# EAGLE design TurquoiseBicuspid_v2 (EAGLE 6.5.0)
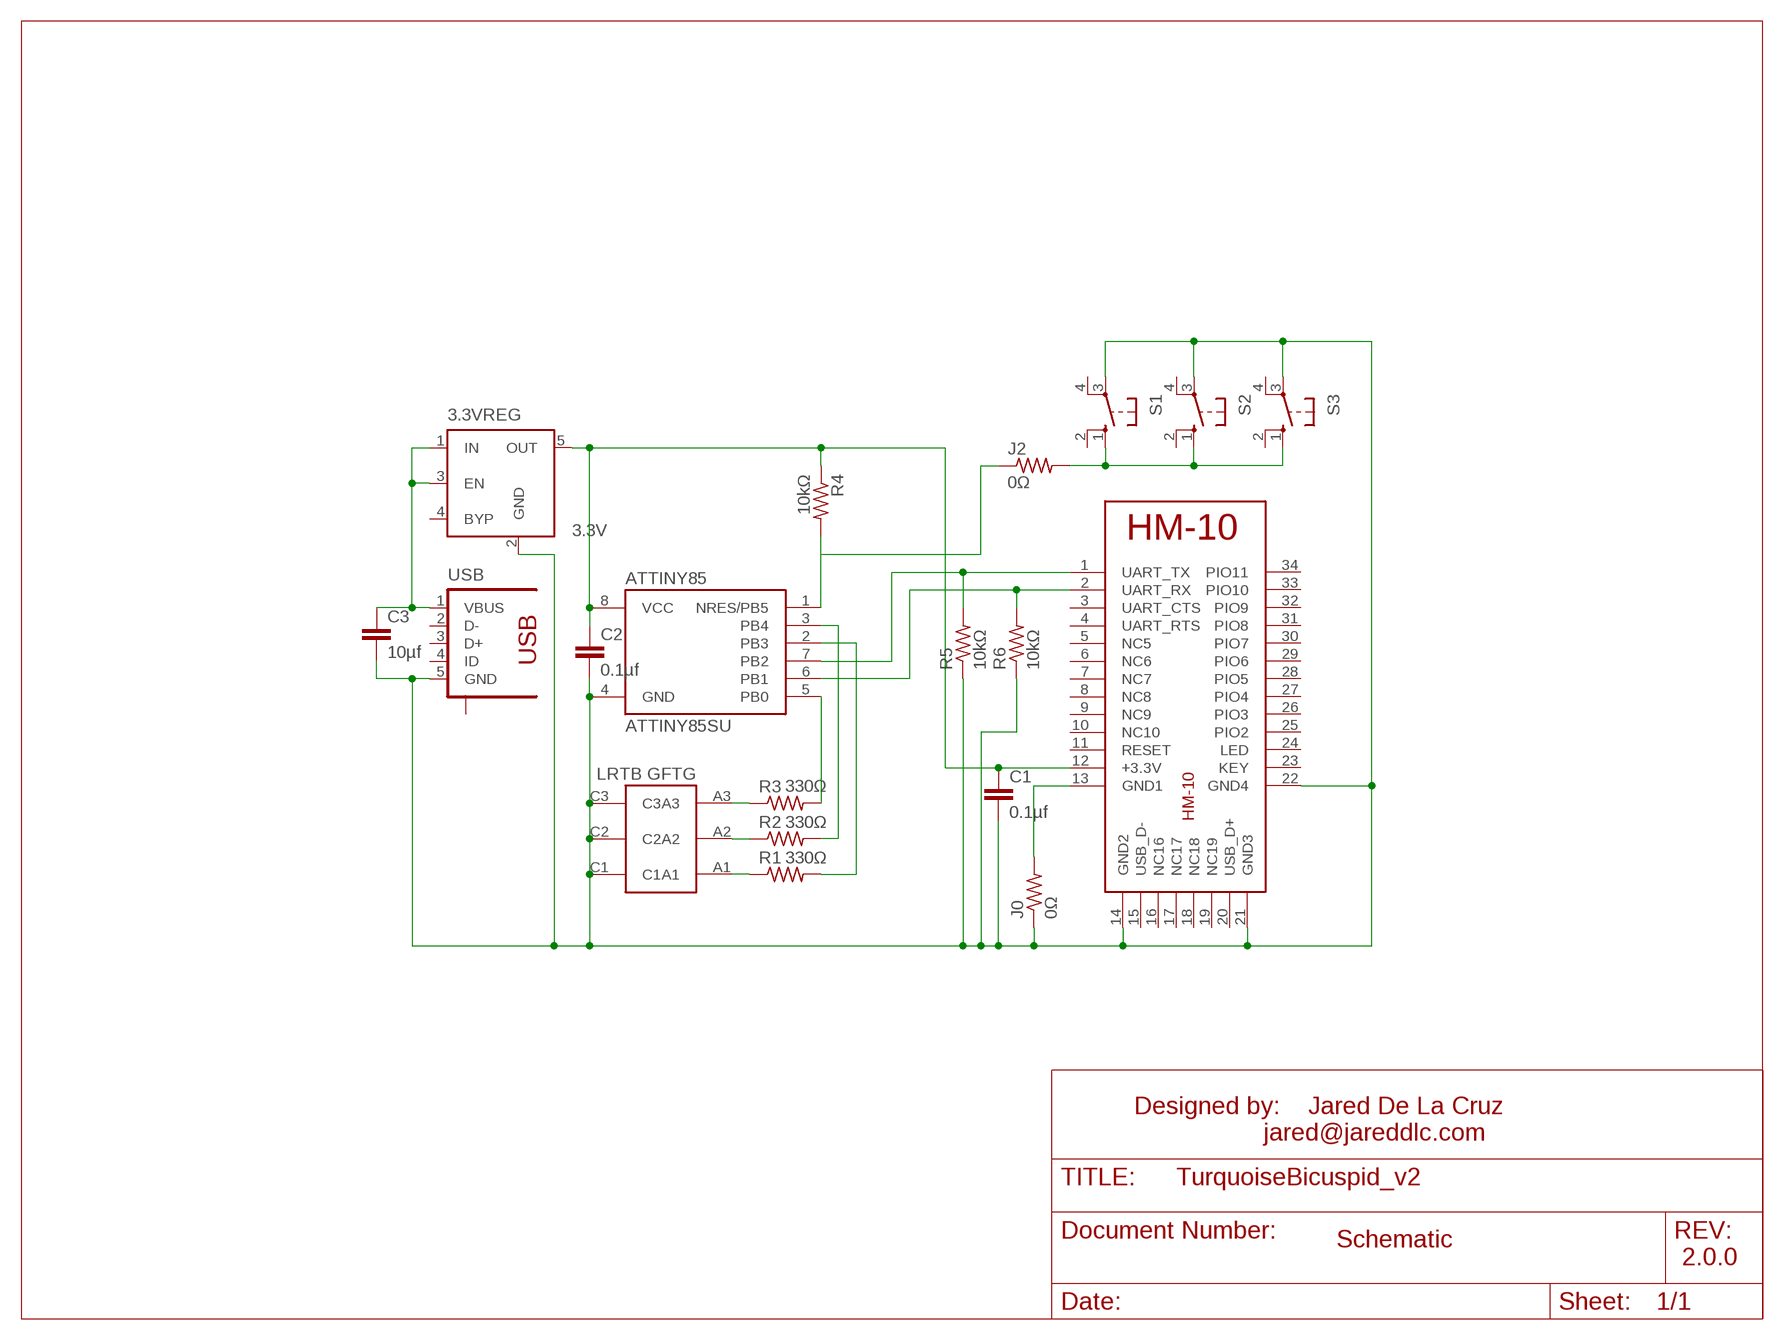
[diagram p0: schematic, sheet 1]
FRAME1 (LETTER_L): VERSION: 2.0.0

## Parts
3.3VREG  3.3V  MIC5219XX  [SOT23-5]
ATTINY85  ATTINY85SU  [ATTINY85]
C1  0.1µf  C-EUC1206  [C1206]
C2  0.1µf  C-EUC1206  [C1206]
C3  10µf  C-EUC1206  [C1206]
HM-10  HM-10BOARD  [HM-10]
J0  0Ω  R-US_R1206  [R1206]
J2  0Ω  R-US_R1206  [R1206]
R1  330Ω  R-US_M1206  [M1206]
R2  330Ω  R-US_M1206  [M1206]
R3  330Ω  R-US_M1206  [M1206]
R4  10kΩ  R-US_R1206  [R1206]
R5  10kΩ  R-US_R1206  [R1206]
R6  10kΩ  R-US_R1206  [R1206]
S1  10-XX  [B3F-10XX]
S2  10-XX  [B3F-10XX]
S3  10-XX  [B3F-10XX]
U$1  LRTB_GFTG  [LRTB_GFTG]
USB  10118192-0001LF  [10118192-0001LF]

## Nets
3.3V: 3.3VREG.5(OUT) ATTINY85.8(VCC) C1.1 C2.1 HM-10.12(+3.3V) R4.1
5V: 3.3VREG.1(IN) 3.3VREG.3(EN) C3.1 USB.1(VBUS)
A1: ATTINY85.2(PB3) R1.1 R1.2 U$1.A1
A2: ATTINY85.3(PB4) R2.1 R2.2 U$1.A2
A3: ATTINY85.5(PB0) R3.1 R3.2 U$1.A3
BT_RX: ATTINY85.6(PB1) HM-10.2(UART_RX) R6.2
BT_TX: ATTINY85.7(PB2) HM-10.1(UART_TX) R5.2
GND: 3.3VREG.2(GND) ATTINY85.4(GND) C1.2 C2.2 C3.2 HM-10.13(GND1) HM-10.14(GND2) HM-10.21(GND3) HM-10.22(GND4) J0.1 J0.2 R5.1 R6.1 S1.3(P) S2.3(P) S3.3(P) U$1.C1 U$1.C2 U$1.C3 USB.5(GND)
RESET: ATTINY85.1(NRES/PB5) J2.1 J2.2 R4.2 S1.1(S) S2.1(S) S3.1(S)
Unconnected: 3.3VREG.4(BYP) HM-10.3(UART_CTS) HM-10.4(UART_RTS) HM-10.5(NC5) HM-10.6(NC6) HM-10.7(NC7) HM-10.8(NC8) HM-10.9(NC9) HM-10.10(NC10) HM-10.11(RESET) HM-10.15(USB_D-) HM-10.16(NC16) HM-10.17(NC17) HM-10.18(NC18) HM-10.19(NC19) HM-10.20(USB_D+) HM-10.23(KEY) HM-10.24(LED) HM-10.25(PIO2) HM-10.26(PIO3) HM-10.27(PIO4) HM-10.28(PIO5) HM-10.29(PIO6) HM-10.30(PIO7) HM-10.31(PIO8) HM-10.32(PIO9) HM-10.33(PIO10) HM-10.34(PIO11) S1.2(S1) S1.4(P1) S2.2(S1) S2.4(P1) S3.2(S1) S3.4(P1) USB.2(D-) USB.3(D+) USB.4(ID) USB.M1(S) USB.M2(S) USB.S1(S) USB.S2(S) USB.S3(S) USB.S4(S)

## Notes on the sheet
- Designed by:    Jared De La Cruz
                  jared@jareddlc.com
- Schematic
- 2.0.0

## Library data of the parts
3.3VREG = v-reg-micrel:MIC5219XX: VOLTAGE REGULATOR; OC_FARNELL: unknown; OC_NEWARK: unknown
ATTINY85 = attiny85:ATTINY85: ATMEL ATtiny 85
C1-C3 = rcl:C-EU: CAPACITOR, European symbol
HM-10 = HM-10:HM-10: HM Bluetooth module use TI CC2540 or CC2541, Master and slave roles in one, transmission version and remote control version and PIO state acquisition functions in one, Support the AT command modify module parameters, Convenient and flexible.
J0 J2 R1-R4 = rcl:R-US_: RESISTOR, American symbol
R5 R6 = resistor:R-US_: RESISTOR, American symbol
S1-S3 = switch-omron:10-XX: OMRON SWITCH; MPN: B3F-1000; OC_FARNELL: 176432; OC_NEWARK: 36M3542
U$1 = osram_led:LRTB_GFTG
USB = fci_micro_usb:10118192-0001LF: USB - microUSB Type B, FCI

## Board
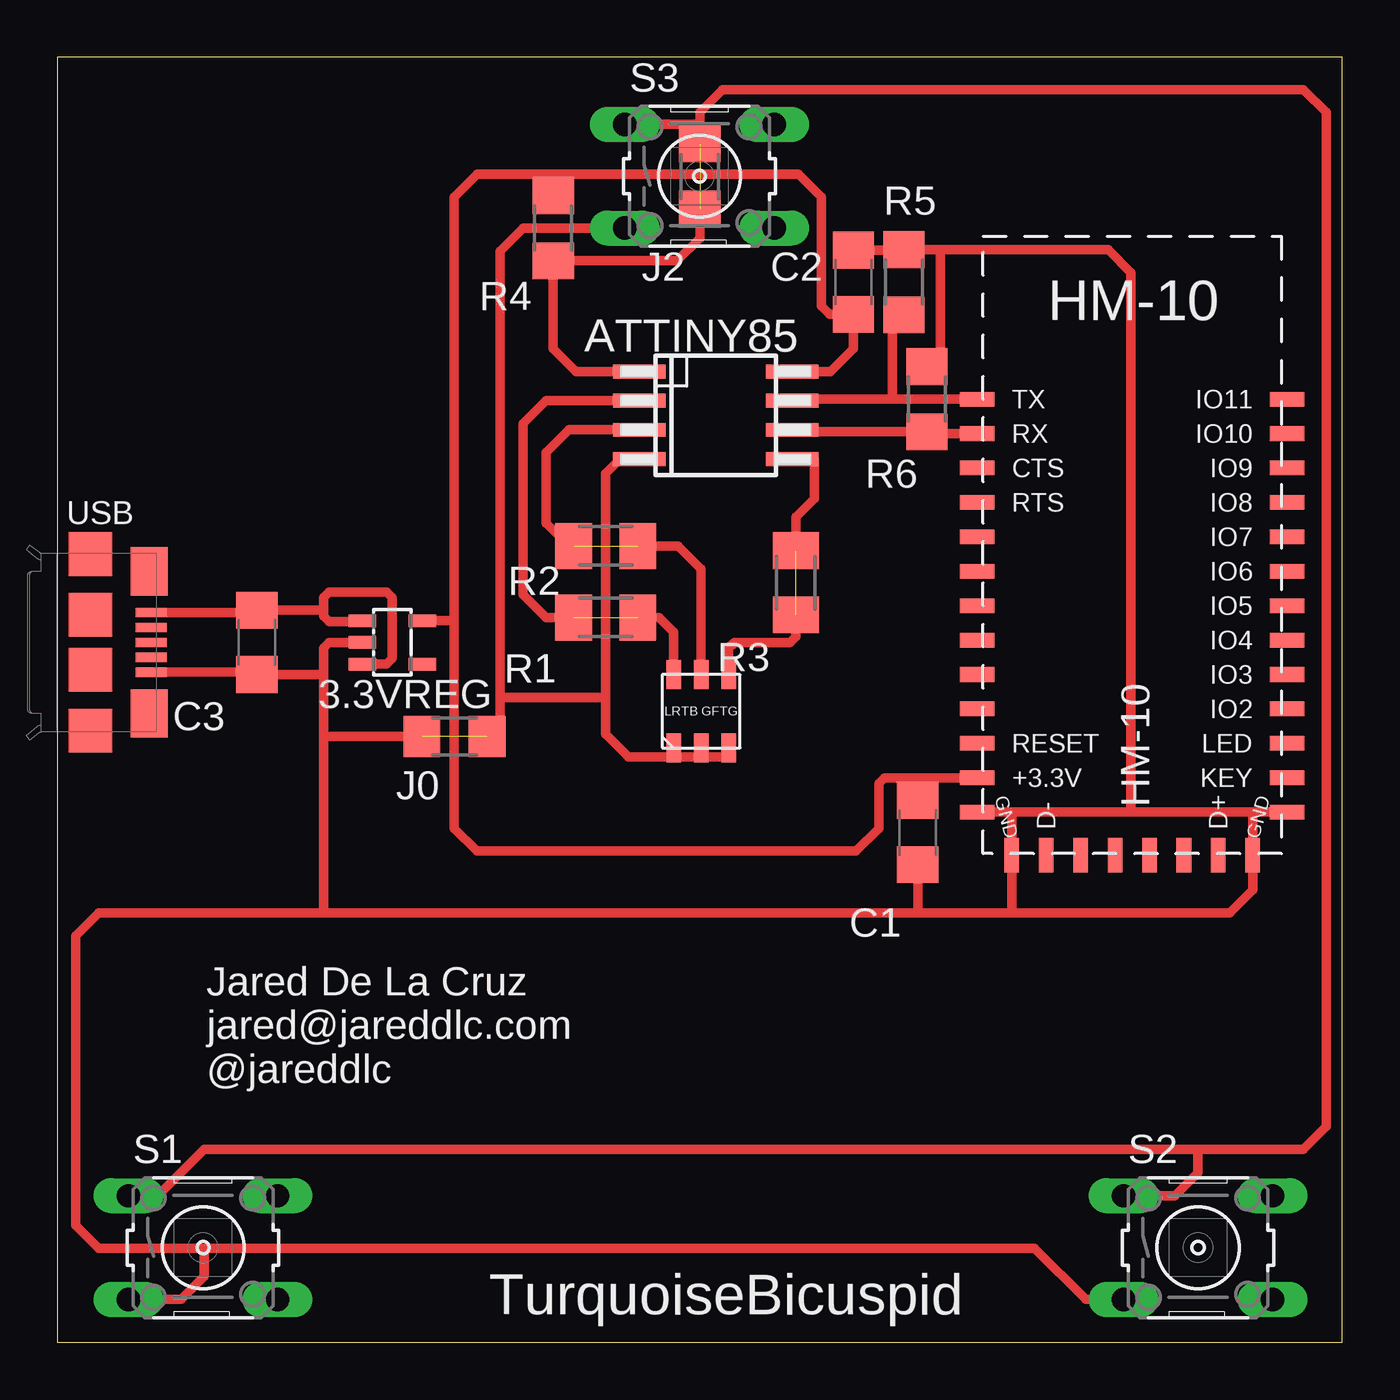
[diagram p1: board, top side]

Size 56 x 56 mm. Coordinates in mm from the lower left corner, seen from the top.
Outline: 0,0 56,0 56,56 0,56 0,0
Copper layers (1*16): Top 0.035mm / dielectric 1.5mm / Bottom 0.035mm
Design rules "default": minimum track width 10mil, minimum drill 24mil, track to track 8mil, track to pad 8mil, pad to pad 8mil, via to via 8mil, smd to smd 8mil, copper to edge 40mil, drill to drill 8mil, minimum pad ring 10mil, minimum via ring 8mil, stop-mask expansion 4mil, vias tented up to drill 0mil, thermal gap 10mil

### Footprints (pad centres in the part's own frame; a part is rotated, then mirrored left to right if it is on the bottom)
SOT23-5 = smd 0.55 x 1.2: 1 -0.95,-1.3; 2 0,-1.3; 3 0.95,-1.3; 4 0.95,1.3; 5 -0.95,1.3
ATTINY85 = smd 0.6 x 2.286: 1 -1.905,-3.33; 2 -0.635,-3.33; 3 0.635,-3.33; 4 1.905,-3.33; 5 1.905,3.33; 6 0.635,3.33; 7 -0.635,3.33; 8 -1.905,3.33
C1206 = smd 1.6 x 1.8: 1 -1.4,0; 2 1.4,0
HM-10 = smd 1.5 x 0.635: 1 -7.5,0; 2 -7.5,-1.5; 3 -7.5,-3; 4 -7.5,-4.5; 5 -7.5,-6; 6 -7.5,-7.5; 7 -7.5,-9; 8 -7.5,-10.5; 9 -7.5,-12; 10 -7.5,-13.5; 11 -7.5,-15; 12 -7.5,-16.5; 13 -7.5,-18; 22 6,-18; 23 6,-16.5; 24 6,-15; 25 6,-13.5; 26 6,-12; 27 6,-10.5; 28 6,-9; 29 6,-7.5; 30 6,-6; 31 6,-4.5; 32 6,-3; 33 6,-1.5; 34 6,0 | smd 0.635 x 1.5: 14 -6,-19.875; 15 -4.5,-19.875; 16 -3,-19.875; 17 -1.5,-19.875; 18 0,-19.875; 19 1.5,-19.875; 20 3,-19.875; 21 4.5,-19.875
R1206 = smd 1.6 x 1.803: 1 -1.422,0; 2 1.422,0
M1206 = smd 1.6 x 2: 1 -1.4,0; 2 1.4,0
B3F-10XX = drill 1.016 long: 1 -3.251,2.261; 2 3.251,2.261; 3 -3.251,-2.261; 4 3.251,-2.261
LRTB_GFTG = smd 0.635 x 1.27: A1 0.5,0; A2 1.7,0; A3 2.9,0; C1 0.5,-3.2; C2 1.7,-3.2; C3 2.9,-3.2
10118192-0001LF = smd 0.4 x 1.35: 1 -1.3,4.1; 2 -0.65,4.1; 3 0,4.1; 4 0.65,4.1; 5 1.3,4.1 | smd 1.9 x 1.9: M1 -1.2,1.45; M2 1.2,1.45; S1 -3.85,1.45; S2 3.85,1.45 | smd 2.1 x 1.6: S3 -3.1,4; S4 3.1,4

### Placement (x,y rotation side)
3.3VREG  14.6,30.5 270 top
ATTINY85  28.7,40.4 270 top
C1  37.5,22.21 270 top
C2  34.7,46.2 90 top
C3  8.7,30.5 270 top
HM-10  47.6,41.1 0 top
J0  17.31,26.4 0 top
J2  28,50.8 90 top
R1  23.9,31.59 180 top
R2  23.9,34.7 0 top
R3  32.19,33.1 90 top
R4  21.61,48.55 270 top
R5  36.9,46.2 270 top
R6  37.9,41.1 270 top
S1  6.35,4.12 0 top
S2  49.72,4.12 0 top
S3  27.99,50.82 0 top
U$1  26.36,29.1 0 top
USB  0,30.5 270 top

### Tracks (layer width: path | path; a pad name or v marks a point on that pad's centre or on a via)
3.3V
  Top 0.406: 3.3VREG.5 17.3,31.45 | 17.3,31.45 17.3,49.9 18.3,50.9 21.61,50.9 | ATTINY85.8 33.7,42.3 34.7,43.3 C2.1 33.65,44.8 33.3,45.15 33.3,49.9 32.3,50.9 21.61,50.9 | HM-10.12 37.5,24.6 | 17.3,31.45 17.3,22.4 18.3,21.4 34.8,21.4 35.8,22.4 35.8,24.35 36.05,24.6 37.5,24.6 | R4.1 21.61,50.9 | 37.5,24.6 C1.1
5V
  Top 0.406: USB.1 8.6,31.8 C3.1 11.6,31.9 | 11.6,31.9 11.6,31.65 11.85,31.4 13.3,31.4 3.3VREG.1 | 3.3VREG.3 14.35,29.55 14.6,29.8 14.6,32.45 14.35,32.7 11.85,32.7 11.6,32.45 11.6,31.9
A1  (1 unrouted)
  Top 0.406: R1.2 21.3,31.59 20.3,32.59 20.3,40.03 21.3,41.03 ATTINY85.2 | U$1.A1 26.86,30.95 26.23,31.59 R1.1
A2  (1 unrouted)
  Top 0.406: 22.3,34.7 R2.1 22.3,34.7 | 22.3,34.7 21.3,35.7 21.3,38.77 22.3,39.77 ATTINY85.3 | U$1.A2 28.06,33.7 27.06,34.7 R2.2
A3  (1 unrouted)
  Top 0.406: ATTINY85.5 33,38.49 33,36.77 32.19,35.97 R3.2 | U$1.A3 29.26,30.25 29.51,30.5 31.94,30.5 32.19,30.75 R3.1
BT_RX
  Top 0.406: 38.5,39.6 38.34,39.77 38.25,39.68 | ATTINY85.6 32.12,39.68 R6.2 38.25,39.68 | 38.25,39.68 38.33,39.6 HM-10.2
BT_TX
  Top 0.406: HM-10.1 36.4,41.1 | 36.4,41.1 32.03,41.1 ATTINY85.7 | R5.2 36.4,44.28 36.4,41.1
GND  (3 unrouted)
  Top 0.406: S1.3 5.4,1.86 6.4,2.86 6.4,4.1 | 6.4,4.1 1.8,4.1 0.8,5.1 0.8,17.7 1.8,18.7 11.6,18.7 | USB.5 8.6,29.2 C3.2 11.6,29.1 | 3.3VREG.2 11.85,30.5 11.6,30.25 11.6,29.1 | 19.3,28.1 19.3,26.4 J0.2 | 19.3,28.1 19.3,47.56 20.3,48.56 S3.3 | 28.1,25.9 U$1.C2 | 11.6,29.1 11.6,26.4 | 11.6,26.4 J0.1 | 54.1,23.1 HM-10.22 52.1,23.1 HM-10.21 52.1,19.7 51.1,18.7 41.6,18.7 | 39.6,23.1 HM-10.13 41.6,23.1 | C1.2 37.5,18.7 | 37.5,18.7 41.6,18.7 | 37.5,18.7 11.6,18.7 | 11.6,18.7 11.6,26.4 | 19.3,28.1 23.9,28.1 | 23.9,28.1 23.9,37.86 24.54,38.49 ATTINY85.4 | R6.1 38.4,43.12 38.5,43.22 38.5,47.62 | 38.5,47.62 45.8,47.62 46.8,46.62 46.8,23.1 | 46.8,23.1 41.6,23.1 | 46.8,23.1 53.5,23.1 | S2.3 44.83,1.86 42.59,4.1 6.4,4.1 | C2.2 36.88,47.6 R5.1 38.5,47.62 | 23.9,28.1 23.9,26.5 24.9,25.5 26.8,25.5 26.8,25.9 U$1.C1 | 41.6,18.7 HM-10.14 41.6,23.1
N$1
  Top 0.406: 26.9,25.5 29.2,25.5
RESET  (1 unrouted)
  Top 0.254: 28,53.08 J2.2
  Top 0.406: ATTINY85.1 22.61,42.3 21.61,43.3 R4.2 27,47.13 28,48.13 J2.1 | S1.1 4.38,6.38 6.4,8.4 49.7,8.4 | 49.7,8.4 49.7,7.38 48.7,6.38 S2.1 | J2.2 28,53.6 29,54.6 54.3,54.6 55.3,53.6 55.3,9.4 54.3,8.4 49.7,8.4 | S3.1 28,53.08

### Text on the board
tPlace: Jared De La Cruz / jared@jareddlc.com / @jareddlc | TurquoiseBicuspid